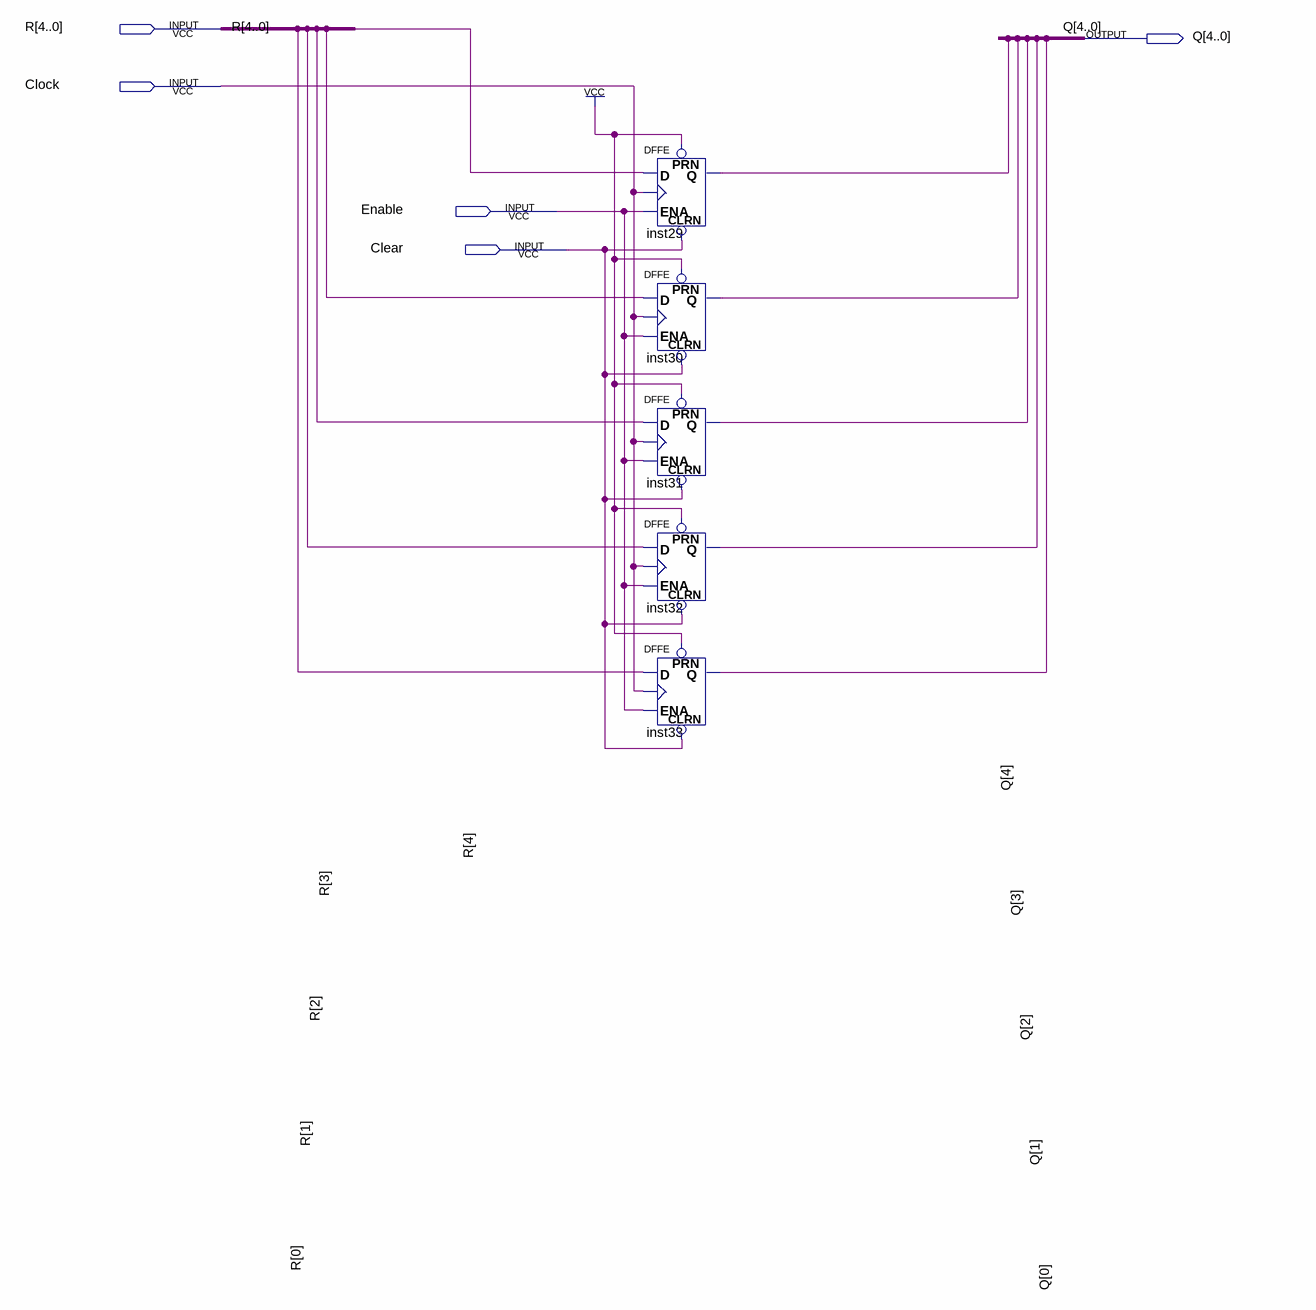
[diagram p0: schematic sheet]
// Quartus schematic Register5.bdf as structural Verilog: 5 symbols, 5 pins
module Register5 (
  input  [4:0] R,
  input  Clock,
  input  Enable,
  input  Clear,
  output [4:0] Q
);

  DFFE inst29 (.PRN(1'b1), .CLRN(Clear), .D(R[4]), .CLK(Clock), .ENA(Enable), .Q(Q[4]));
  DFFE inst30 (.PRN(1'b1), .CLRN(Clear), .D(R[3]), .CLK(Clock), .ENA(Enable), .Q(Q[3]));
  DFFE inst31 (.PRN(1'b1), .CLRN(Clear), .D(R[2]), .CLK(Clock), .ENA(Enable), .Q(Q[2]));
  DFFE inst32 (.PRN(1'b1), .CLRN(Clear), .D(R[1]), .CLK(Clock), .ENA(Enable), .Q(Q[1]));
  DFFE inst33 (.PRN(1'b1), .CLRN(Clear), .D(R[0]), .CLK(Clock), .ENA(Enable), .Q(Q[0]));
endmodule
